# Altium schematic sheet [5] - MICROCONTROLLER.SchDoc: Remote Board
size A4; CheckedBy: Rafael Lang; CompanyName: Gear Labs; DrawnBy: Pedro Neves; Organization: Gear Labs; DocumentNumber: 001/2019; Revision: v1.0; SheetNumber: 5; SheetTotal: 6; ProjectName: Control Board
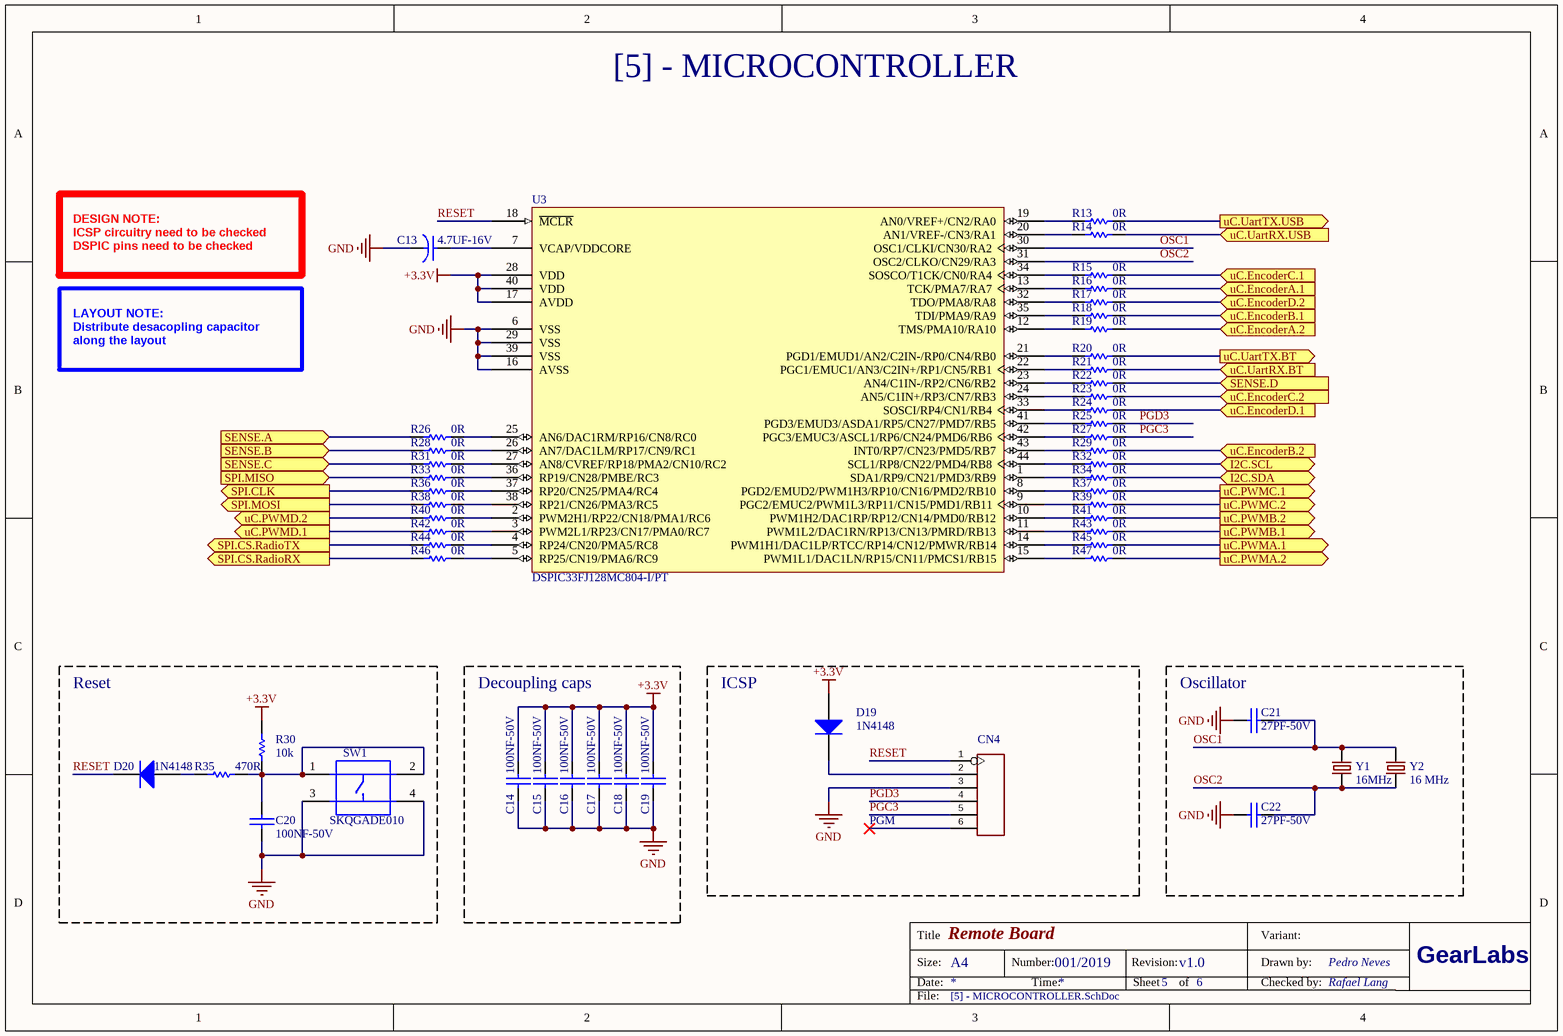
[diagram p0: [5] - MICROCONTROLLER.SchDoc]

## Parts
C13  value 4.7UF-16V  [AVX-A]  (hidden comment: 302020006)
C14  value 100NF-50V  [C0603]  (hidden comment: 302010138)
C15  value 100NF-50V  [C0603]  (hidden comment: 302010138)
C16  value 100NF-50V  [C0603]  (hidden comment: 302010138)
C17  value 100NF-50V  [C0603]  (hidden comment: 302010138)
C18  value 100NF-50V  [C0603]  (hidden comment: 302010138)
C19  value 100NF-50V  [C0603]  (hidden comment: 302010138)
C20  value 100NF-50V  [C0603]  (hidden comment: 302010138)
C21  value 27PF-50V  [C0603]  (hidden comment: 302010142)
C22  value 27PF-50V  [C0603]  (hidden comment: 302010142)
CN4  320030060  [H6-2.54]  (value not drawn)
D19  MPN: 1N4148  [LL-34]  (hidden comment: 304040016)
D20  MPN: 1N4148  [LL-34]  (hidden comment: 304040016)
R13  value 0R  [R0603]  (hidden comment: 301010292)
R14  value 0R  [R0603]  (hidden comment: 301010292)
R15  value 0R  [R0603]  (hidden comment: 301010292)
R16  value 0R  [R0603]  (hidden comment: 301010292)
R17  value 0R  [R0603]  (hidden comment: 301010292)
R18  value 0R  [R0603]  (hidden comment: 301010292)
R19  value 0R  [R0603]  (hidden comment: 301010292)
R20  value 0R  [R0603]  (hidden comment: 301010292)
R21  value 0R  [R0603]  (hidden comment: 301010292)
R22  value 0R  [R0603]  (hidden comment: 301010292)
R23  value 0R  [R0603]  (hidden comment: 301010292)
R24  value 0R  [R0603]  (hidden comment: 301010292)
R25  value 0R  [R0603]  (hidden comment: 301010292)
R26  value 0R  [R0603]  (hidden comment: 301010292)
R27  value 0R  [R0603]  (hidden comment: 301010292)
R28  value 0R  [R0603]  (hidden comment: 301010292)
R29  value 0R  [R0603]  (hidden comment: 301010292)
R30  value 10k  [R0603]  (hidden comment: 301010299)
R31  value 0R  [R0603]  (hidden comment: 301010292)
R32  value 0R  [R0603]  (hidden comment: 301010292)
R33  value 0R  [R0603]  (hidden comment: 301010292)
R34  value 0R  [R0603]  (hidden comment: 301010292)
R35  value 470R  [R0603]  (hidden comment: 301010088)
R36  value 0R  [R0603]  (hidden comment: 301010292)
R37  value 0R  [R0603]  (hidden comment: 301010292)
R38  value 0R  [R0603]  (hidden comment: 301010292)
R39  value 0R  [R0603]  (hidden comment: 301010292)
R40  value 0R  [R0603]  (hidden comment: 301010292)
R41  value 0R  [R0603]  (hidden comment: 301010292)
R42  value 0R  [R0603]  (hidden comment: 301010292)
R43  value 0R  [R0603]  (hidden comment: 301010292)
R44  value 0R  [R0603]  (hidden comment: 301010292)
R45  value 0R  [R0603]  (hidden comment: 301010292)
R46  value 0R  [R0603]  (hidden comment: 301010292)
R47  value 0R  [R0603]  (hidden comment: 301010292)
SW1  MPN: SKQGADE010  [SW4-SMD-5.2X5.2X1.5MM]  (hidden comment: 311020017)
U3  DSPIC33FJ128MC804-I/PT  [TQFP-44]
Y1  value 16MHz  [X2-SMD-5.0X3.2X1.3MM]  (hidden comment: 306010054)
Y2  value 16 MHz  [HC49US]  (hidden comment: 306010014)

## Blocks framed on the sheet
Reset: C20 D20 R30 R35 SW1
Decoupling caps: C14-C19
ICSP: CN4 D19
Oscillator: C21 C22 Y1 Y2

## Ports
I2C.SCL (bidir), I2C.SDA (bidir), SENSE.A (in), SENSE.B (in), SENSE.C (in), SENSE.D (in), SPI.CLK (out), SPI.CS.RadioRX (out), SPI.CS.RadioTX (out), SPI.MISO (in), SPI.MOSI (out), uC.EncoderA.1 (in), uC.EncoderA.2 (in), uC.EncoderB.1 (in), uC.EncoderB.2 (in), uC.EncoderC.1 (in), uC.EncoderC.2 (in), uC.EncoderD.1 (in), uC.EncoderD.2 (in), uC.PWMA.1 (out), uC.PWMA.2 (out), uC.PWMB.1 (out), uC.PWMB.2 (out), uC.PWMC.1 (out), uC.PWMC.2 (out), uC.PWMD.1 (out), uC.PWMD.2 (out), uC.UartRX.BT (in), uC.UartRX.USB (in), uC.UartTX.BT (out), uC.UartTX.USB (out)

## Nets
+3.3V: C14.1 C15.1 C16.1 C17.1 C18.1 C19.1 D19.A(+) R30.2 U3.17(AVDD) U3.28(VDD) U3.40(VDD)
GND: C13.- C14.2 C15.2 C16.2 C17.2 C18.2 C19.2 C20.2 C21.2 C22.2 CN4.3 SW1.3(B0) SW1.4(B1) U3.6(VSS) U3.16(AVSS) U3.29(VSS) U3.39(VSS)
I2C.SCL: R32.2 ; port I2C.SCL
I2C.SDA: R34.2 ; port I2C.SDA
OSC1: C21.1 U3.30(OSC1/CLKI/CN30/RA2) Y1.2 Y2.2
OSC2: C22.1 U3.31(OSC2/CLKO/CN29/RA3) Y1.1 Y2.1
PGC3: CN4.5 R27.2
PGD3: CN4.4 R25.2
RESET: CN4.1 D20.C(-) U3.18(~{MCLR})
SENSE.A: R26.1 ; port SENSE.A
SENSE.B: R28.1 ; port SENSE.B
SENSE.C: R31.1 ; port SENSE.C
SENSE.D: R22.2 ; port SENSE.D
SPI.CLK: R36.1 ; port SPI.CLK
SPI.CS.RadioRX: R46.1 ; port SPI.CS.RadioRX
SPI.CS.RadioTX: R44.1 ; port SPI.CS.RadioTX
SPI.MISO: R33.1 ; port SPI.MISO
SPI.MOSI: R38.1 ; port SPI.MOSI
uC.EncoderA.1: R16.2 ; port uC.EncoderA.1
uC.EncoderA.2: R19.2 ; port uC.EncoderA.2
uC.EncoderB.1: R18.2 ; port uC.EncoderB.1
uC.EncoderB.2: R29.2 ; port uC.EncoderB.2
uC.EncoderC.1: R15.2 ; port uC.EncoderC.1
uC.EncoderC.2: R23.2 ; port uC.EncoderC.2
uC.EncoderD.1: R24.2 ; port uC.EncoderD.1
uC.EncoderD.2: R17.2 ; port uC.EncoderD.2
uC.PWMA.1: R45.2 ; port uC.PWMA.1
uC.PWMA.2: R47.2 ; port uC.PWMA.2
uC.PWMB.1: R43.2 ; port uC.PWMB.1
uC.PWMB.2: R41.2 ; port uC.PWMB.2
uC.PWMC.1: R37.2 ; port uC.PWMC.1
uC.PWMC.2: R39.2 ; port uC.PWMC.2
uC.PWMD.1: R42.1 ; port uC.PWMD.1
uC.PWMD.2: R40.1 ; port uC.PWMD.2
uC.UartRX.BT: R21.2 ; port uC.UartRX.BT
uC.UartRX.USB: R14.2 ; port uC.UartRX.USB
uC.UartTX.BT: R20.2 ; port uC.UartTX.BT
uC.UartTX.USB: R13.2 ; port uC.UartTX.USB
NetC13_+: C13.+ U3.7(VCAP/VDDCORE)
NetC20_1: C20.1 R30.1 R35.2 SW1.1(A0) SW1.2(A1)
NetCN4_2: CN4.2 D19.C(-)
NetD20_A: D20.A(+) R35.1
NetR13_1: R13.1 U3.19(AN0/VREF+/CN2/RA0)
NetR14_1: R14.1 U3.20(AN1/VREF-/CN3/RA1)
NetR15_1: R15.1 U3.34(SOSCO/T1CK/CN0/RA4)
NetR16_1: R16.1 U3.13(TCK/PMA7/RA7)
NetR17_1: R17.1 U3.32(TDO/PMA8/RA8)
NetR18_1: R18.1 U3.35(TDI/PMA9/RA9)
NetR19_1: R19.1 U3.12(TMS/PMA10/RA10)
NetR20_1: R20.1 U3.21(PGD1/EMUD1/AN2/C2IN-/RP0/CN4/RB0)
NetR21_1: R21.1 U3.22(PGC1/EMUC1/AN3/C2IN+/RP1/CN5/RB1)
NetR22_1: R22.1 U3.23(AN4/C1IN-/RP2/CN6/RB2)
NetR23_1: R23.1 U3.24(AN5/C1IN+/RP3/CN7/RB3)
NetR24_1: R24.1 U3.33(SOSCI/RP4/CN1/RB4)
NetR25_1: R25.1 U3.41(PGD3/EMUD3/ASDA1/RP5/CN27/PMD7/RB5)
NetR26_2: R26.2 U3.25(AN6/DAC1RM/RP16/CN8/RC0)
NetR27_1: R27.1 U3.42(PGC3/EMUC3/ASCL1/RP6/CN24/PMD6/RB6)
NetR28_2: R28.2 U3.26(AN7/DAC1LM/RP17/CN9/RC1)
NetR29_1: R29.1 U3.43(INT0/RP7/CN23/PMD5/RB7)
NetR31_2: R31.2 U3.27(AN8/CVREF/RP18/PMA2/CN10/RC2)
NetR32_1: R32.1 U3.44(SCL1/RP8/CN22/PMD4/RB8)
NetR33_2: R33.2 U3.36(RP19/CN28/PMBE/RC3)
NetR34_1: R34.1 U3.1(SDA1/RP9/CN21/PMD3/RB9)
NetR36_2: R36.2 U3.37(RP20/CN25/PMA4/RC4)
NetR37_1: R37.1 U3.8(PGD2/EMUD2/PWM1H3/RP10/CN16/PMD2/RB10)
NetR38_2: R38.2 U3.38(RP21/CN26/PMA3/RC5)
NetR39_1: R39.1 U3.9(PGC2/EMUC2/PWM1L3/RP11/CN15/PMD1/RB11)
NetR40_2: R40.2 U3.2(PWM2H1/RP22/CN18/PMA1/RC6)
NetR41_1: R41.1 U3.10(PWM1H2/DAC1RP/RP12/CN14/PMD0/RB12)
NetR42_2: R42.2 U3.3(PWM2L1/RP23/CN17/PMA0/RC7)
NetR43_1: R43.1 U3.11(PWM1L2/DAC1RN/RP13/CN13/PMRD/RB13)
NetR44_2: R44.2 U3.4(RP24/CN20/PMA5/RC8)
NetR45_1: R45.1 U3.14(PWM1H1/DAC1LP/RTCC/RP14/CN12/PMWR/RB14)
NetR46_2: R46.2 U3.5(RP25/CN19/PMA6/RC9)
NetR47_1: R47.1 U3.15(PWM1L1/DAC1LN/RP15/CN11/PMCS1/RB15)

Not connected (* = marked no-connect by the designer): CN4 6*

## Notes on the sheet
- [5] - MICROCONTROLLER
- DESIGN NOTE:
  ICSP circuitry need to be checked
  DSPIC pins need to be checked
- LAYOUT NOTE:
  Distribute desacopling capacitor along the layout
- PGM
- Title
- Size:
- Date:
- A4
- Number:
- Time:
- Revision:
- Sheet
- of
- Drawn by:
- Checked by:
- Variant:
- GearLabs
- File:

## Library data of the parts
C13 = TANTALUM-SMD-4.7UF-16V(AVX-A): MPN: TAJA475*016#NJ
C14-C20 = CERAMIC-100NF-50V-10%-X7R(0603): MPN: CC0603KRX7R9BB104
C21 C22 = CERAMIC-27PF-50V-5%-NPO(0603): MPN: CC0603JRNPO9BN270
CN4 = DIP-BLACK-FEMALE-HEADER-VERT(6P-2.54): MPN: F185-1106A1BSYC1
D19 D20 = SMD-DIODE-SWITCH-1N4148(LL-34)
R13-R29 R31-R34 R36-R47 = SMD-RES-0R-5%-1/10W(0603): MPN: RC0603JR-070RL
R30 = SMD-RES-10K-1%-1/10W(0603): MPN: RC0603FR-0710KL
R35 = SMD-RES-470R-5%-1/10W(0603): MPN: RC0603JR-07470RL
SW1 = SMD-BUTTON(4P-5.2X5.2X1.5MM-SKQGADE010)-SKQGADE010
U3 = DSPIC33FJ128MC804-I/PT: High-Performance 16-bit Digital Signal Controller, 128 KB Flash, 16 KB RAM, 44-Pin TQFP; FLASH Memory Size: 131072 B; Lead-Free Status: Lead Free; RAM Memory Size: 16384 B; Lifecycle Status: Active; Mounting Style: Surface Mount; Number of Pins: 44; REACH SVHC Compliance: No SVHC; RoHS: Compliant
Y1 = SMD-CRYSTAL-16MHZ-8PF-20PPM-40R(2P-5.0X3.2MM): MPN: X053201602002
Y2 = DIP-CRYSTAL-16MHZ-18PF-30PPM-40R(HC49US): MPN: HC-49US    16.000MHz